# EAGLE design board (EAGLE 9.5.1)
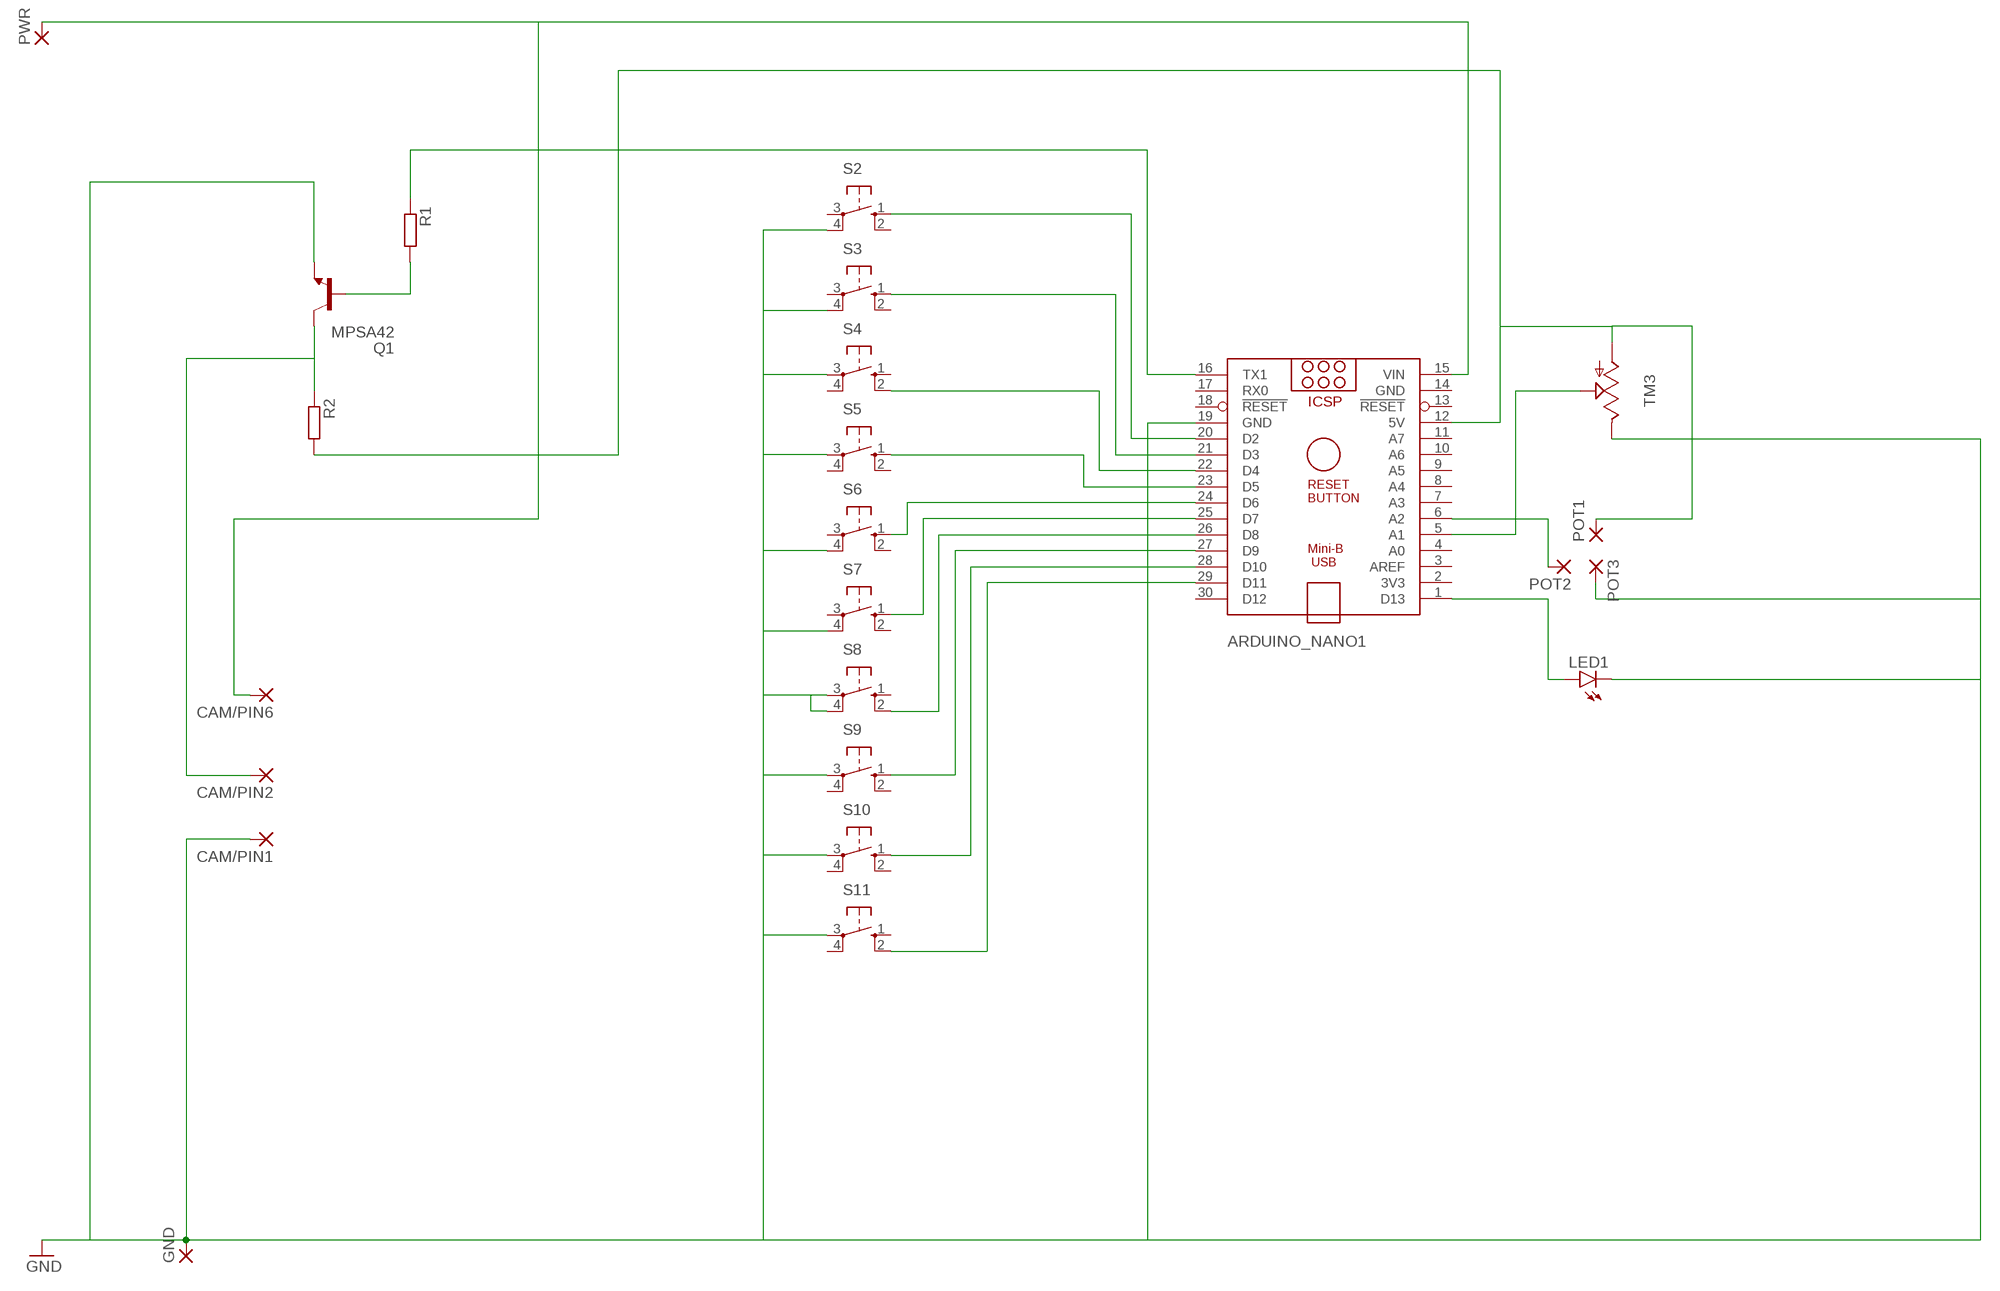
[diagram p0: schematic, sheet 1]

## Parts
ARDUINO_NANO1  ARDUINO_NANO  [ARDUINO_NANO]
CAM/PIN1  1,6/0,8  [1,6/0,8]
CAM/PIN2  1,6/0,8  [1,6/0,8]
CAM/PIN6  1,6/0,8  [1,6/0,8]
GND  1,6/0,8  [1,6/0,8]
LED1  LED5MM  [LED5MM]
POT1  1,6/0,8  [1,6/0,8]
POT2  1,6/0,8  [1,6/0,8]
POT3  1,6/0,8  [1,6/0,8]
PWR  1,6/0,8  [1,6/0,8]
Q1  MPSA42  [TO92]
R1  R-EU_0204/2V  [0204V]
R2  R-EU_0204/2V  [0204V]
S2  40-XX  [B3F-40XX]
S3  40-XX  [B3F-40XX]
S4  40-XX  [B3F-40XX]
S5  40-XX  [B3F-40XX]
S6  40-XX  [B3F-40XX]
S7  40-XX  [B3F-40XX]
S8  40-XX  [B3F-40XX]
S9  40-XX  [B3F-40XX]
S10  40-XX  [B3F-40XX]
S11  40-XX  [B3F-40XX]
TM3  TRIMSLIDE75  [SLIDEPOT-75]

## Nets
GND [ground]: ARDUINO_NANO1.19(GND) CAM/PIN1.1(P) GND.1(P) LED1.K(C) POT3.1(P) Q1.3(E) S2.4(P1) S3.4(P1) S4.3(P) S5.3(P) S6.4(P1) S7.4(P1) S8.3(P) S8.4(P1) S9.3(P) S10.3(P) S11.3(P) TM3.B
N$2: ARDUINO_NANO1.12(5V) POT1.1(P) R2.2 TM3.A
N$3: ARDUINO_NANO1.20(D2) S2.1(S)
N$4: ARDUINO_NANO1.21(D3) S3.1(S)
N$5: ARDUINO_NANO1.22(D4) S4.2(S1)
N$6: ARDUINO_NANO1.23(D5) S5.1(S)
N$7: ARDUINO_NANO1.24(D6) S6.1(S)
N$8: ARDUINO_NANO1.25(D7) S7.1(S)
N$9: ARDUINO_NANO1.26(D8) S8.2(S1)
N$10: ARDUINO_NANO1.27(D9) S9.1(S)
N$11: ARDUINO_NANO1.28(D10) S10.1(S)
N$12: ARDUINO_NANO1.29(D11) S11.2(S1)
N$13: ARDUINO_NANO1.15(VIN) CAM/PIN6.1(P) PWR.1(P)
N$14: ARDUINO_NANO1.16(TX1) R1.1
N$15: Q1.2(B) R1.2
N$16: ARDUINO_NANO1.5(A1) TM3.WIPER
N$17: ARDUINO_NANO1.6(A2) POT2.1(P)
N$18: CAM/PIN2.1(P) Q1.1(C) R2.1
N$19: ARDUINO_NANO1.1(D13) LED1.A
Unconnected: ARDUINO_NANO1.2(3V3) ARDUINO_NANO1.3(AREF) ARDUINO_NANO1.4(A0) ARDUINO_NANO1.7(A3) ARDUINO_NANO1.8(A4) ARDUINO_NANO1.9(A5) ARDUINO_NANO1.10(A6) ARDUINO_NANO1.11(A7) ARDUINO_NANO1.13(!RESET) ARDUINO_NANO1.17(RX0) ARDUINO_NANO1.18(!RESET) ARDUINO_NANO1.30(D12) S2.2(S1) S2.3(P) S3.2(S1) S3.3(P) S4.1(S) S4.4(P1) S5.2(S1) S5.4(P1) S6.2(S1) S6.3(P) S7.2(S1) S7.3(P) S8.1(S) S9.2(S1) S9.4(P1) S10.2(S1) S10.4(P1) S11.1(S) S11.4(P1)

## Power pins joined to a net without a drawn wire
GND: ARDUINO_NANO1.14(GND)

## Library data of the parts
ARDUINO_NANO1 = ArduinoNanoV30:ARDUINO_NANO: Arduino Nano V3.0 Overview: The Arduino Nano is a small, complete, and breadboard-friendly board based on the ATmega328 (Arduino Nano 3.x) or ATmega168 (Arduino Nano 2.x). It has more or less the same functionality of the Arduino Duemilanove, but in a different package. It lacks only a DC power jack, and works with a Mini-B USB cable instead of a standard one. The Nano was designed and is being produced by Gravitech. Specifications: Microcontroller Atmel ATmega168 or ATmega328 Operating Voltage (logic level) 5 V Input Voltage (recommended) 7-12 V Input Voltage (limits) 6-20 V Digital I/O Pins 14 (of which 6 provide PWM output) Analog Input Pins 8 DC Current per I/O Pin 40 mA Flash Memory 16 KB (ATmega168) or 32 KB (ATmega328) of which 2 KB used by bootloader SRAM 1 KB (ATmega168) or 2 KB (ATmega328) EEPROM 512 bytes (ATmega168) or 1 KB (ATmega328) Clock Speed 16 MHz Dimensions 0.73" x 1.70" Length 45 mm Width 18 mm Weigth 5 g Power: The Arduino Nano can be powered via the Mini-B USB connection, 6-20V unregulated external power supply (pin 30), or 5V regulated external power supply (pin 27). The power source is automatically selected to the highest voltage source. Memory: The ATmega168 has 16 KB of flash memory for storing code (of which 2 KB is used for the bootloader); the ATmega328 has 32 KB, (also with 2 KB used for the bootloader). The ATmega168 has 1 KB of SRAM and 512 bytes of EEPROM (which can be read and written with the EEPROM library); the ATmega328 has 2 KB of SRAM and 1 KB of EEPROM. Input and Output: Each of the 14 digital pins on the Nano can be used as an input or output, using pinMode(), digitalWrite(), and digitalRead() functions. They operate at 5 volts. Each pin can provide or receive a maximum of 40 mA and has an internal pull-up resistor (disconnected by default) of 20-50 kOhms. In addition, some pins have specialized functions. Visit Arduino - ArduinoBoardNano <https://www.arduino.cc/en/Main/ArduinoBoardNano>
CAM/PIN1 CAM/PIN2 CAM/PIN6 GND POT1-POT3 PWR = wirepad:1,6/0,8: THROUGH-HOLE PAD
LED1 = led:LED: LED OSRAM: - CHIPLED LG R971, LG N971, LY N971, LG Q971, LY Q971, LO R971, LY R971 LH N974, LH R974 LS Q976, LO Q976, LY Q976 LO Q996 - Hyper CHIPLED LW Q18S LB Q993, LB Q99A, LB R99A - SideLED LS A670, LO A670, LY A670, LG A670, LP A670 LB A673, LV A673, LT A673, LW A673 LH A674 LY A675 LS A676, LA A676, LO A676, LY A676, LW A676 LS A679, LY A679, LG A679 - Hyper Micro SIDELED® LS Y876, LA Y876, LO Y876, LY Y876 LT Y87S - SmartLED LW L88C, LW L88S LB L89C, LB L89S, LG L890 LS L89K, LO L89K, LY L89K LS L896, LA L896, LO L896, LY L896 - TOPLED LS T670, LO T670, LY T670, LG T670, LP T670 LSG T670, LSP T670, LSY T670, LOP T670, LYG T670 LG T671, LOG T671, LSG T671 LB T673, LV T673, LT T673, LW T673 LH T674 LS T676, LA T676, LO T676, LY T676, LB T676, LH T676, LSB T676, LW T676 LB T67C, LV T67C, LT T67C, LS T67K, LO T67K, LY T67K, LW E67C LS E67B, LA E67B, LO E67B, LY E67B, LB E67C, LV E67C, LT E67C LW T67C LS T679, LY T679, LG T679 LS T770, LO T770, LY T770, LG T770, LP T770 LB T773, LV T773, LT T773, LW T773 LH T774 LS E675, LA E675, LY E675, LS T675 LS T776, LA T776, LO T776, LY T776, LB T776 LHGB T686 LT T68C, LB T68C - Hyper Mini TOPLED® LB M676 - Mini TOPLED Santana® LG M470 LS M47K, LO M47K, LY M47K Source: http://www.osram.convergy.de LUXEON: - LUMILED® LXK2-PW12-R00, LXK2-PW12-S00, LXK2-PW14-U00, LXK2-PW14-V00 LXK2-PM12-R00, LXK2-PM12-S00, LXK2-PM14-U00 LXK2-PE12-Q00, LXK2-PE12-R00, LXK2-PE12-S00, LXK2-PE14-T00, LXK2-PE14-U00 LXK2-PB12-K00, LXK2-PB12-L00, LXK2-PB12-M00, LXK2-PB14-N00, LXK2-PB14-P00, LXK2-PB14-Q00 LXK2-PR12-L00, LXK2-PR12-M00, LXK2-PR14-Q00, LXK2-PR14-R00 LXK2-PD12-Q00, LXK2-PD12-R00, LXK2-PD12-S00 LXK2-PH12-R00, LXK2-PH12-S00 LXK2-PL12-P00, LXK2-PL12-Q00, LXK2-PL12-R00 Source: www.luxeon.com KINGBRIGHT: KA-3528ASYC Source: www.kingbright.com
Q1 = MPSA42:MPSA42: NPN TRANSISTOR; AVAILABILITY: Unavailable; DESCRIPTION: TRANSISTOR, NPN, TO-92; Transistor Type: Bipolar; Transistor Polarity: NPN; Collector-to-Emitter Breakdown Voltage: 3...; MF: Central Semiconductor; MP: MPSA42; PACKAGE: TO-92 Multicomp; PRICE: None
R1 R2 = rcl:R-EU_: RESISTOR, European symbol; SPICEPREFIX: R
S2-S11 = switch-omron:40-XX: OMRON SWITCH; MF: OMRON COMPONENTS USA; MPN: B3F-4000; OC_FARNELL: 176434; OC_NEWARK: 36K3105
TM3 = Bourns PTA series:TRIM: Sliding potentiometers Based on Adafruits (https://github.com/adafruit/Adafruit-Eagle-Library) 'TRIM' device. For Bourns PTA series and TT Electronics PSxx series potentiometers.

## Net classes
0 default: width 0.406 mm, clearance 0.406 mm
1 ground: width 0.61 mm, clearance 0.61 mm

## Board
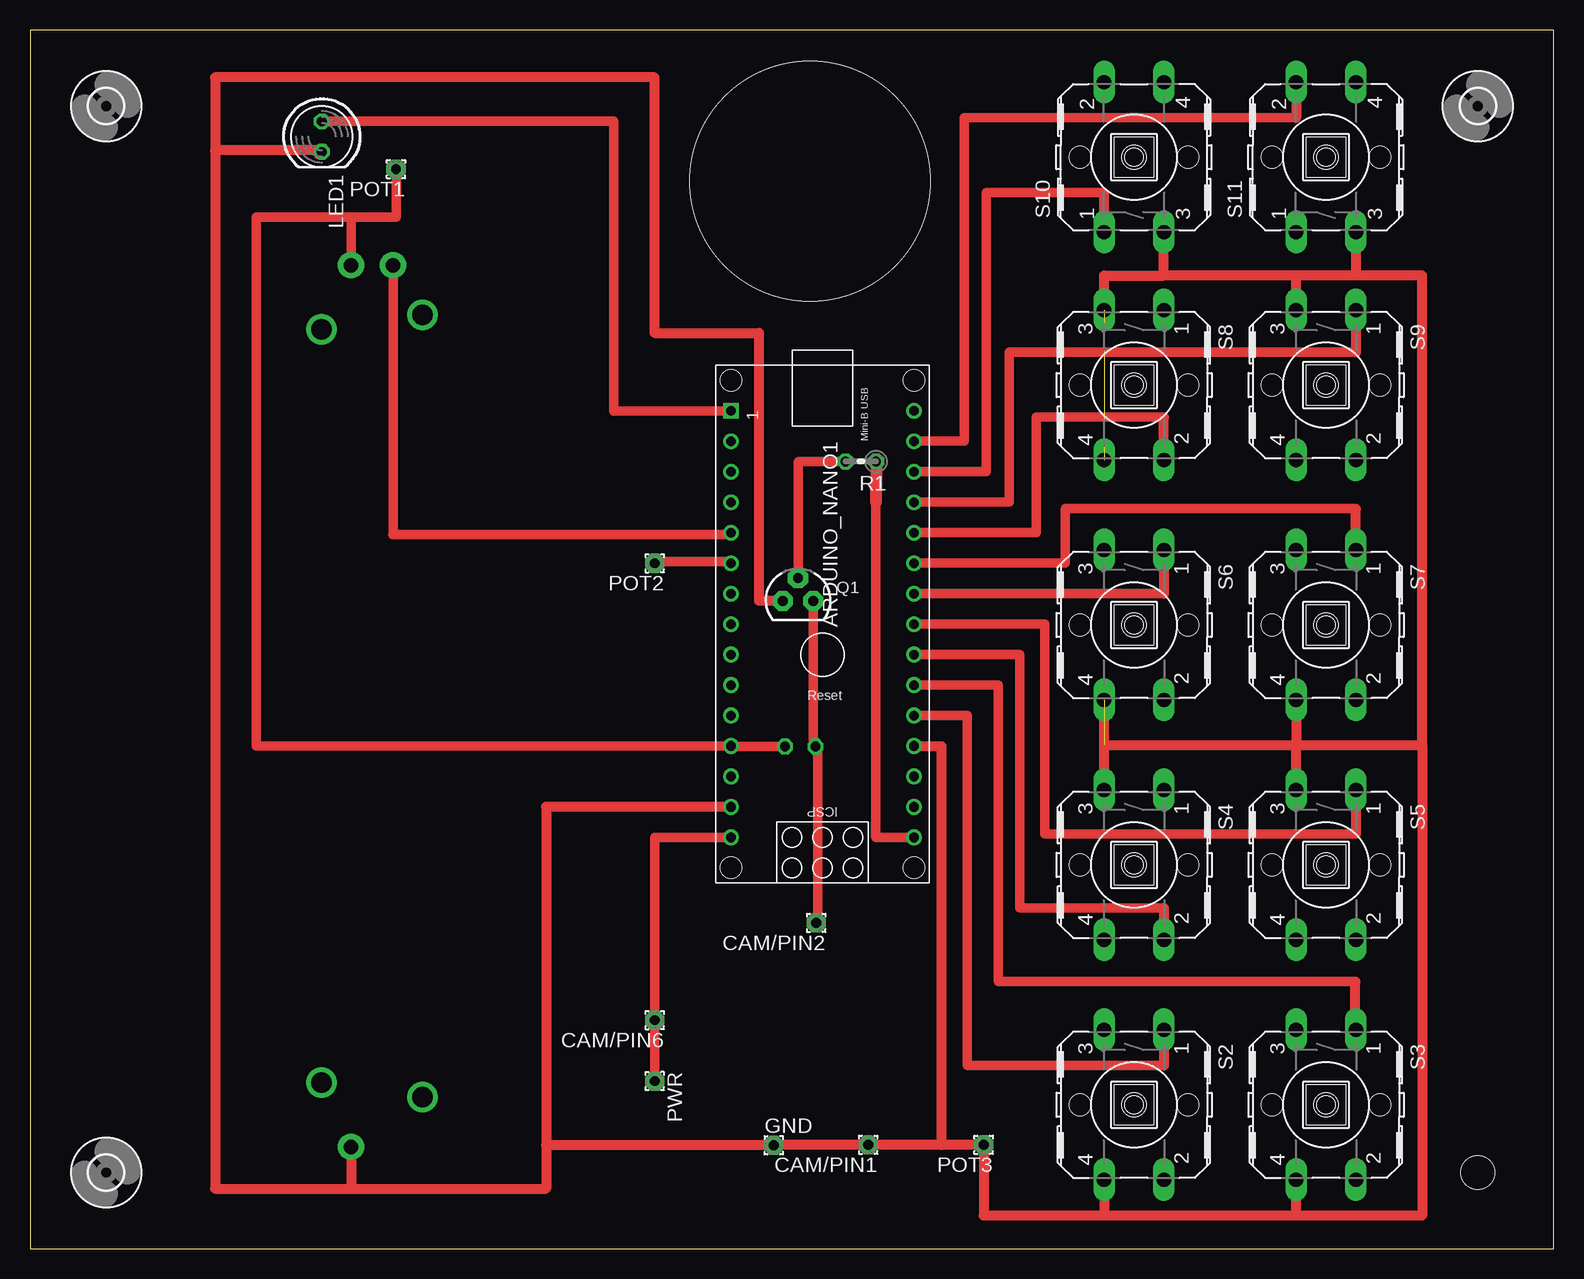
[diagram p1: board, top side]
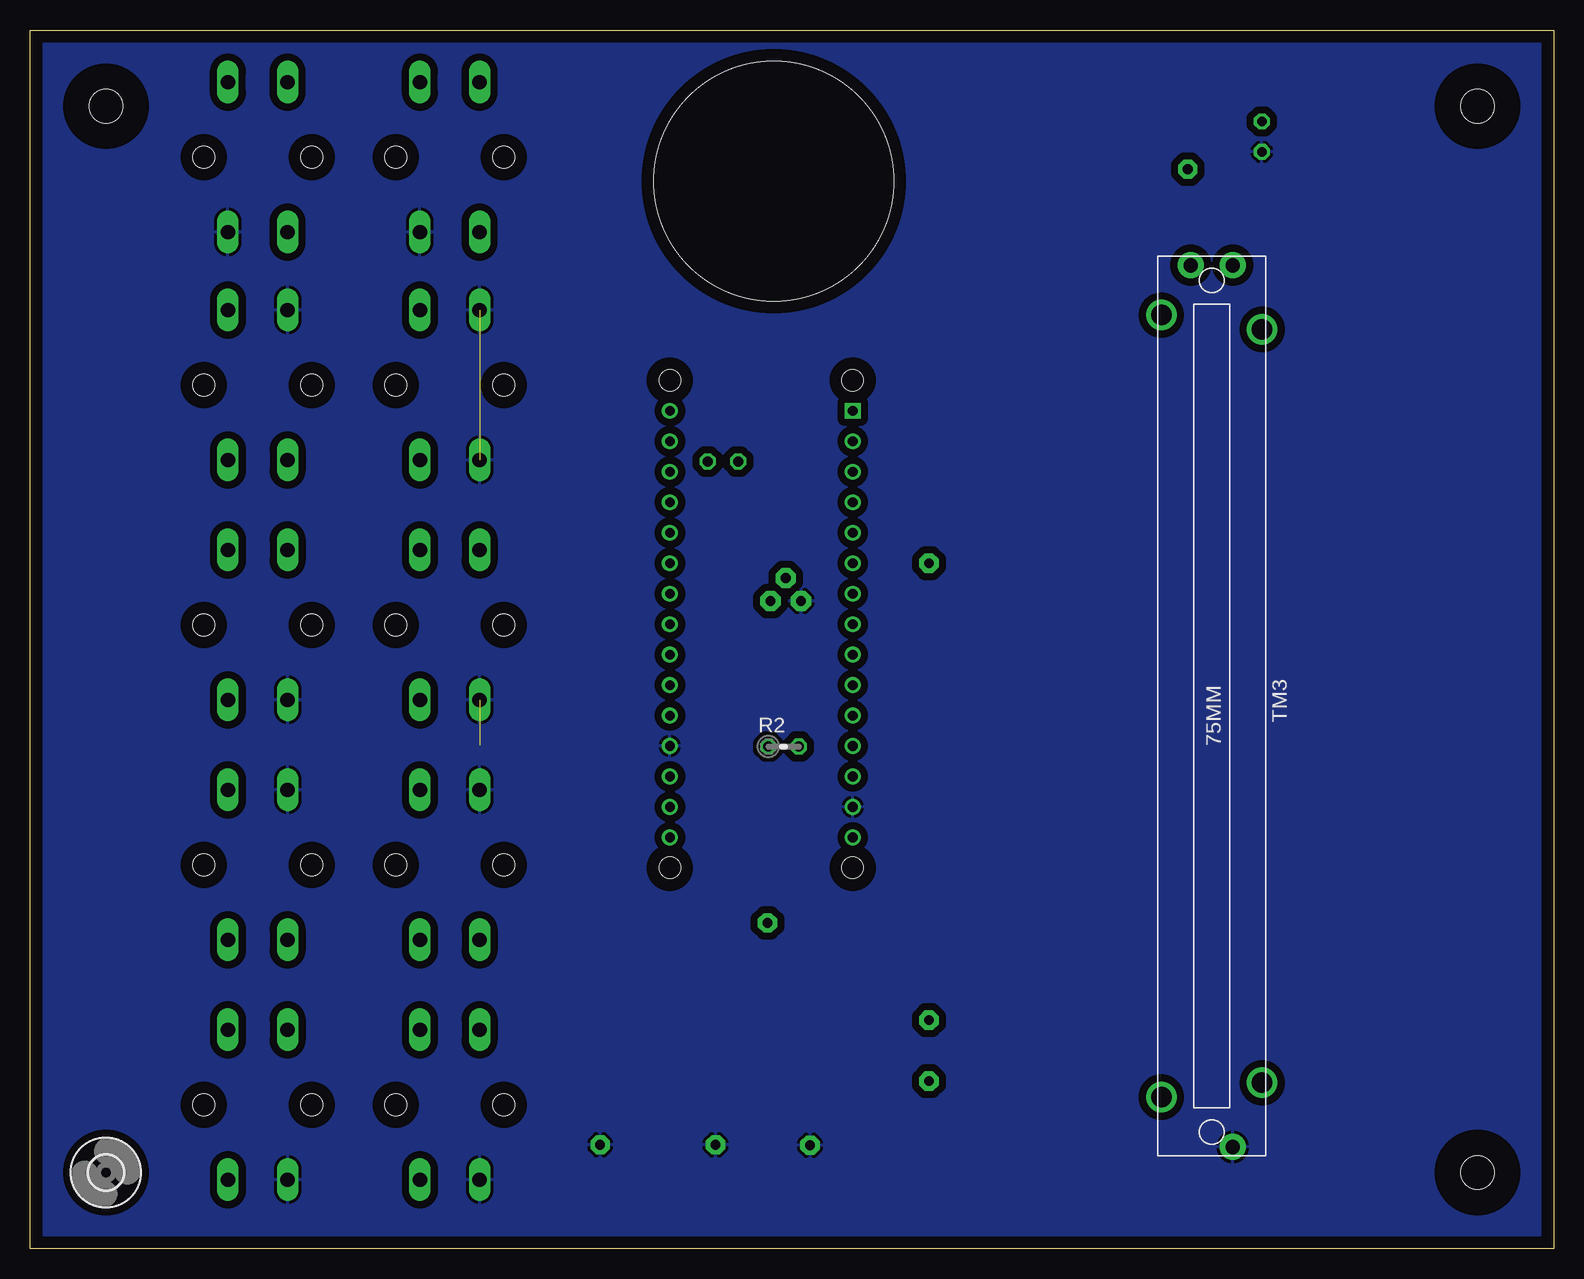
[diagram p2: board, bottom side, seen from below]

Size 126.98 x 101.6 mm. Coordinates in mm from the lower left corner, seen from the top.
Outline: 0,0 126.98,0 126.98,101.6 0,101.6 0,0
Copper layers (1*16): Top 0.035mm / dielectric 1.5mm / Bottom 0.035mm
Design rules "default": minimum track width 6mil, minimum drill 0.35mm, track to track 6mil, track to pad 6mil, pad to pad 6mil, via to via 6mil, smd to smd 6mil, copper to edge 40mil, drill to drill 6mil, minimum pad ring 10mil, minimum via ring 8mil, stop-mask expansion 4mil, vias tented up to drill 0mil, thermal gap 10mil
Holes 20 mm at 65,89

### Footprints (pad centres in the part's own frame; a part is rotated, then mirrored left to right if it is on the bottom)
ARDUINO_NANO = drill 0.8 square: 1 -20.32,-7.62 | drill 0.8: 2 -17.78,-7.62; 3 -15.24,-7.62; 4 -12.7,-7.62; 5 -10.16,-7.62; 6 -7.62,-7.62; 7 -5.08,-7.62; 8 -2.54,-7.62; 9 0,-7.62; 10 2.54,-7.62; 11 5.08,-7.62; 12 7.62,-7.62; 13 10.16,-7.62; 14 12.7,-7.62; 15 15.24,-7.62; 16 15.24,7.62; 17 12.7,7.62; 18 10.16,7.62; 19 7.62,7.62; 20 5.08,7.62; 21 2.54,7.62; 22 0,7.62; 23 -2.54,7.62; 24 -5.08,7.62; 25 -7.62,7.62; 26 -10.16,7.62; 27 -12.7,7.62; 28 -15.24,7.62; 29 -17.78,7.62; 30 -20.32,7.62 | hole 1.778: -22.86,-7.62; -22.86,7.62; 17.78,7.62; 17.78,-7.62
1,6/0,8 = drill 0.813 pad 1.6 octagon: 1 0,0
LED5MM = drill 0.813 octagon: A -1.27,0; K 1.27,0
TO92 = drill 0.813 pad 1.676 octagon: 1 1.27,0; 2 0,1.905; 3 -1.27,0
0204V = drill 0.813 octagon: 1 -1.27,0; 2 1.27,0
B3F-40XX = drill 1.194 long: 1 -6.248,2.489; 2 6.248,2.489; 3 -6.248,-2.489; 4 6.248,-2.489 | hole 1.803: 0,-4.496; 0,4.496
SLIDEPOT-75 = drill 1.2 pad 2.184: A -36.99,1.75; B 36.514,1.75; WIPER -36.99,-1.75 | drill 1.7 pad 2.54: P$1 -31.64,4.2; P$2 31.164,4.2; P$3 -32.84,-4.2; P$4 32.364,-4.2
2,8 = hole 2.8: 0,0

### Placement (x,y rotation side)
ARDUINO_NANO1  66.04,49.53 270 top
CAM/PIN1  69.85,8.66 180 top
CAM/PIN2  65.52,27.16 180 top
CAM/PIN6  52.07,19.05 180 top
GND  61.97,8.62 0 top
LED1  24.32,92.71 270 top
POT1  30.5,90 180 top
POT2  52.07,57.15 180 top
POT3  79.47,8.66 180 top
PWR  52.07,13.97 270 top
Q1  64,54 0 top
R1  69.24,65.63 180 top
R2  64.19,41.87 0 bottom
S2  92,12 270 top
S3  108,12 270 top
S4  92,32 270 top
S5  108,32 270 top
S6  92,52 270 top
S7  108,52 270 top
S8  92,72 270 top
S9  108,72 270 top
S10  92,91 90 top
S11  108,91 90 top
TM3  28.5,45 270 bottom
U$1  [2,8]  6.35,95.25 0 top
U$2  [2,8]  6.35,6.35 0 top
U$3  [2,8]  120.65,95.25 0 top
U$4  [2,8]  120.65,6.35 0 bottom

### Tracks (layer width: path | path; a pad name or v marks a point on that pad's centre or on a via)
GND  (2 unrouted)
  Top 0.61: LED1.K 24,91.12
  Top 0.813: S8.3 89.51,81.13 94.49,81.13 | 94.49,81.13 S10.3 | S9.3 105.51,81.13 | 105.51,81.13 94.49,81.13 | S11.3 110.49,81.13 | 110.49,81.13 105.51,81.13 | S7.4 105.51,42 | 116,42 116,81.13 110.49,81.13 | 105.51,42 116,42 | S5.3 105.51,42 | 89.51,42 105.51,42 | S4.3 S6.4 | 89.51,2.75 79.47,2.75 POT3.1 75.97,8.66 | 105.51,2.75 89.51,2.75 | 105.51,2.75 S3.4 | S2.4 89.51,2.75 | ARDUINO_NANO1.14 43,36.83 43,8.62 | 43,8.62 43,5 26.75,5 | 43,8.62 GND.1 62.02,8.66 CAM/PIN1.1 75.97,8.66 | TM3.B 26.75,5 | 26.75,5 15.43,5 15.43,91.56 | LED1.K 24.2,91.56 15.43,91.56 | 15.43,91.56 15.43,97.66 52.05,97.66 52.05,76.35 60.73,76.35 60.73,54 Q1.3 | ARDUINO_NANO1.19 75.97,41.91 75.97,8.66 | 116,42 116,2.75 105.51,2.75
  pour Bottom: 0,101.5 127,101.5 127,0 0,0
N$2
  Top 0.406: 62.8,41.86 R2.2 | 58.52,41.86 ARDUINO_NANO1.12
  Top 0.8: ARDUINO_NANO1.12 18.85,41.91 18.85,86 26.73,86 | 26.73,86 30.5,86 POT1.1 | 58.52,41.86 62.8,41.86 | 26.73,81.99 TM3.A 26.75,85.98 26.73,86
N$3
  Top 0.8: ARDUINO_NANO1.20 78.09,44.45 78.09,15.27 94.49,15.27
  Top 0.813: S2.1 94.49,15.27
N$4
  Top 0.8: ARDUINO_NANO1.21 80.67,46.99 80.67,22.27 110.44,22.27
  Top 0.813: S3.1 110.44,18.3 110.44,22.27
N$5
  Top 0.8: ARDUINO_NANO1.22 82.49,49.53 82.49,28.4 94.49,28.4
  Top 0.813: 94.49,28.4 S4.2
N$6
  Top 0.8: 110.48,34.58 84.55,34.58 84.55,52.07 ARDUINO_NANO1.23
  Top 0.813: S5.1 110.49,34.59 110.48,34.58
N$7
  Top 0.8: 94.49,54.61 ARDUINO_NANO1.24
  Top 0.813: S6.1 94.49,54.61
N$8
  Top 0.8: 110.49,61.69 86.29,61.69 86.29,57.15 ARDUINO_NANO1.25
  Top 0.813: S7.1 110.49,61.69
N$9
  Top 0.8: ARDUINO_NANO1.26 83.83,59.69 83.83,69.32 94.49,69.32
  Top 0.813: S8.2 94.49,69.32
N$10
  Top 0.8: ARDUINO_NANO1.27 81.6,62.23 81.6,74.73 110.48,74.73
  Top 0.813: S9.1 110.48,74.73
N$11
  Top 0.8: ARDUINO_NANO1.28 79.69,64.77 79.69,88.03 89.51,88.03
  Top 0.813: S10.1 89.51,88.03
N$12
  Top 0.8: ARDUINO_NANO1.29 77.83,67.31 77.83,94.27 105.51,94.27
  Top 0.813: S11.2 105.51,94.27
N$13
  Top 0.8: ARDUINO_NANO1.15 52.07,34.29 CAM/PIN6.1 PWR.1
N$14
  Top 0.8: ARDUINO_NANO1.16 70.48,34.29 70.48,62.28
  Top 1: R1.1 70.48,62.28
N$15
  Top 0.406: 64.05,65.63 64,65.58
  Top 0.8: R1.2 64.05,65.63 | 64,65.58 Q1.2
N$16
  Top 0.406: 58.32,59.54 ARDUINO_NANO1.5 | 30.24,59.54 30.29,59.69
  Top 0.8: 58.32,59.54 30.24,59.54 30.25,59.55 TM3.WIPER
N$17
  Top 0.406: 58.32,57.3 ARDUINO_NANO1.6 | 52.22,57.3 POT2.1
  Top 0.8: 52.22,57.3 58.32,57.3
N$18
  Top 0.406: 65.5,41.83 R2.1
  Top 0.8: Q1.1 65.27,42.05 R2.1 65.65,41.67 65.65,27.28 CAM/PIN2.1
N$19
  Top 0.8: ARDUINO_NANO1.1 48.63,69.85 48.63,93.98 LED1.A